# Altium schematic sheet RemoteCar_V1.0.SchDoc
size A4; SheetNumber: 1; SheetTotal: 1
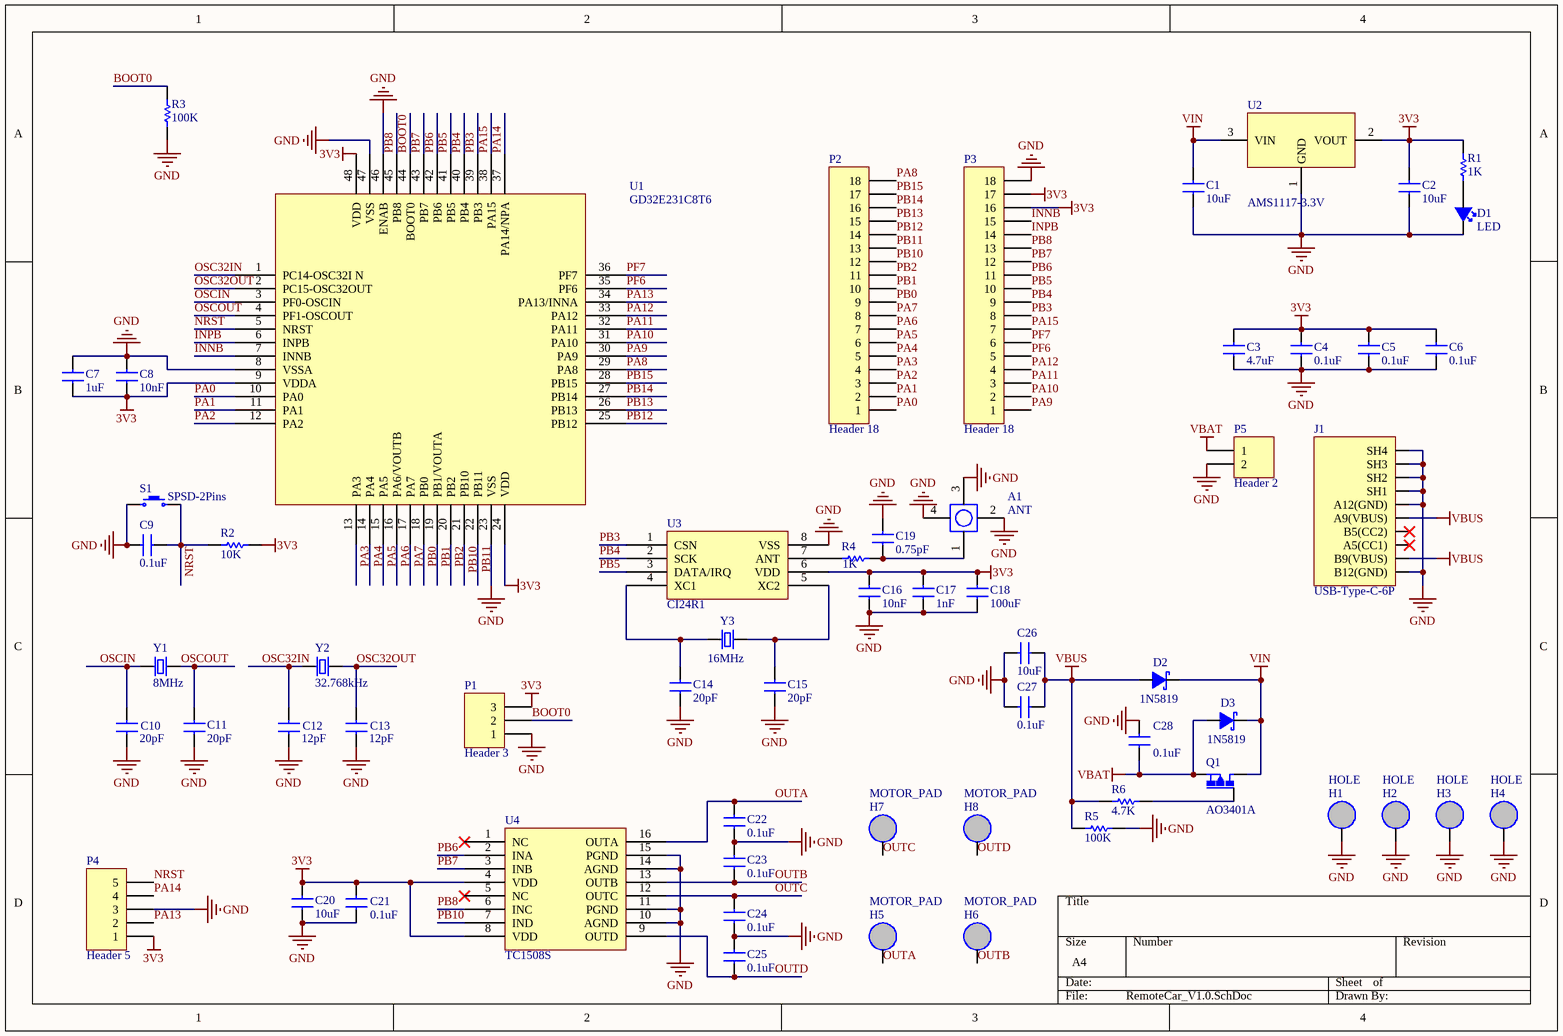
[diagram p0: RemoteCar_V1.0.SchDoc]

## Parts
A1  ANT  [IPEX1]
C1  10uF  [CAP-0603]
C2  10uF  [CAP-0603]
C3  4.7uF  [CAP-0603]
C4  0.1uF  [CAP-0402]
C5  0.1uF  [CAP-0402]
C6  0.1uF  [CAP-0402]
C7  1uF  [CAP-0402]
C8  10nF  [CAP-0402]
C9  0.1uF  [CAP-0402]
C10  20pF  [CAP-0603]
C11  20pF  [CAP-0603]
C12  12pF  [CAP-0603]
C13  12pF  [CAP-0603]
C14  20pF  [CAP-0603]
C15  20pF  [CAP-0603]
C16  10nF  [CAP-0402]
C17  1nF  [CAP-0402]
C18  100uF  [CAP-1206]
C19  0.75pF  [CAP-0402]
C20  10uF  [CAP-0603]
C21  0.1uF  [CAP-0402]
C22  0.1uF  [CAP-0402]
C23  0.1uF  [CAP-0402]
C24  0.1uF  [CAP-0402]
C25  0.1uF  [CAP-0402]
C26  10uF  [CAP-0603]
C27  0.1uF  [CAP-0402]
C28  0.1uF  [CAP-0402]
D1  LED  [LED-0603]
D2  1N5819  [DO-214AC]
D3  1N5819  [DO-214AC]
H1  HOLE  [HOLE]
H2  HOLE  [HOLE]
H3  HOLE  [HOLE]
H4  HOLE  [HOLE]
H5  MOTOR_PAD  [MOTOR_PAD]
H6  MOTOR_PAD  [MOTOR_PAD]
H7  MOTOR_PAD  [MOTOR_PAD]
H8  MOTOR_PAD  [MOTOR_PAD]
J1  USB-Type-C-6P  [USB-Type-C-6P]
P1  Header 3  [HDR1X3]
P2  Header 18  [HDR1X18]
P3  Header 18  [HDR1X18]
P4  Header 5  [HDR1X5]
P5  Header 2  [HDR1X2]
Q1  AO3401A  [SOT95P240X115-3N]
R1  1K  [RES-0603]
R2  10K  [RES-0603]
R3  100K  [RES-0603]
R4  1K  [RES-0603]
R5  100K  [RES-0603]
R6  4.7K  [RES-0603]
S1  SPSD-2Pins  [TS-1101-X-X]
U1  GD32E231C8T6  [LQFP-48]
U2  AMS1117-3.3V  [SOT230P700X180-4N]
U3  CI24R1  [TSOP127P600X145-8N]
U4  TC1508S  [SOP127P600X180-16N]
Y1  8MHz  [HC-49S]
Y2  32.768kHz  [DT-26]
Y3  16MHz  [HC-49S]

## Nets
3V3: C2.2 C3.2 C4.2 C5.2 C6.2 C7.1 C8.1 C16.1 C17.1 C18.1 C20.1 C21.1 P1.3 P3.16 P3.17 P4.1 R1.2 R2.2 U1.9(VDDA) U1.24(VDD) U1.48(VDD) U2.2(VOUT) U3.6(VDD) U4.4(VDD) U4.8(VDD)
GND: A1.2(GND) A1.3(GND) A1.4(GND) C1.1 C2.1 C3.1 C4.1 C5.1 C6.1 C7.2 C8.2 C9.2 C10.2 C11.2 C12.2 C13.2 C14.2 C15.1 C16.2 C17.2 C18.2 C19.1 C20.2 C21.2 C22.1 C23.1 C24.2 C25.1 C26.2 C27.2 C28.2 D1.2(Cathode) H1.1(GND) H2.1(GND) H3.1(GND) H4.1(GND) J1.1(B12(GND)) J1.6(A12(GND)) J1.7(SH1) J1.8(SH2) J1.9(SH3) J1.10(SH4) P1.1 P3.18 P4.3 P5.2 R3.1 R5.2 S1.1 U1.8(VSSA) U1.23(VSS) U1.46(ENAB) U1.47(VSS) U2.1(GND) U3.8(VSS) U4.10(AGND) U4.11(PGND) U4.14(AGND) U4.15(PGND)
VBAT: C28.1 D3.1(Positive) P5.1 Q1.2(S)
VBUS: C26.1 C27.1 D2.1(Positive) J1.2(B9(VBUS)) J1.5(A9(VBUS)) R5.1 R6.1
VIN: C1.2 D2.2(Cathode) D3.2(Cathode) Q1.3(D) U2.3(VIN)
BOOT0: P1.2 R3.2 U1.44(BOOT0)
INNB: P3.15 U1.7(INNB)
INPB: P3.14 U1.6(INPB)
NRST: C9.1 P4.5 R2.1 S1.2 U1.5(NRST)
OSC32IN: C12.1 U1.1(PC14-OSC32I_N) Y2.1
OSC32OUT: C13.1 U1.2(PC15-OSC32OUT) Y2.2
OSCIN: C10.1 U1.3(PF0-OSCIN) Y1.1
OSCOUT: C11.1 U1.4(PF1-OSCOUT) Y1.2
OUTA: C22.2 H5.1(MOTOR) U4.16(OUTA)
OUTB: C23.2 H6.1(MOTOR) U4.13(OUTB)
OUTC: C24.1 H7.1(MOTOR) U4.12(OUTC)
OUTD: C25.2 H8.1(MOTOR) U4.9(OUTD)
PA0: P2.1 U1.10(PA0)
PA1: P2.2 U1.11(PA1)
PA2: P2.3 U1.12(PA2)
PA3: P2.4 U1.13(PA3)
PA4: P2.5 U1.14(PA4)
PA5: P2.6 U1.15(PA5)
PA6: P2.7 U1.16(PA6/VOUTB)
PA7: P2.8 U1.17(PA7)
PA8: P2.18 U1.29(PA8)
PA9: P3.1 U1.30(PA9)
PA10: P3.2 U1.31(PA10)
PA11: P3.3 U1.32(PA11)
PA12: P3.4 U1.33(PA12)
PA13: P4.2 U1.34(PA13/INNA)
PA14: P4.4 U1.37(PA14/NPA)
PA15: P3.7 U1.38(PA15)
PB0: P2.9 U1.18(PB0)
PB1: P2.10 U1.19(PB1/VOUTA)
PB2: P2.11 U1.20(PB2)
PB3: P3.8 U1.39(PB3) U3.1(CSN)
PB4: P3.9 U1.40(PB4) U3.2(SCK)
PB5: P3.10 U1.41(PB5) U3.3(DATA/IRQ)
PB6: P3.11 U1.42(PB6) U4.2(INA)
PB7: P3.12 U1.43(PB7) U4.3(INB)
PB8: P3.13 U1.45(PB8) U4.6(INC)
PB10: P2.12 U1.21(PB10) U4.7(IND)
PB11: P2.13 U1.22(PB11)
PB12: P2.14 U1.25(PB12)
PB13: P2.15 U1.26(PB13)
PB14: P2.16 U1.27(PB14)
PB15: P2.17 U1.28(PB15)
PF6: P3.5 U1.35(PF6)
PF7: P3.6 U1.36(PF7)
NetA1_1: A1.1(SIG) C19.2 R4.2
NetC14_1: C14.1 U3.4(XC1) Y3.1
NetC15_2: C15.2 U3.5(XC2) Y3.2
NetD1_1: D1.1(Positive) R1.1
NetQ1_1: Q1.1(G) R6.2
NetR4_1: R4.1 U3.7(ANT)

Not connected (* = marked no-connect by the designer): J1 3(A5(CC1))* 4(B5(CC2))*; U4 1(NC)* 5(NC)*

## Library data of the parts
C1-C28 = Capacitor
D2 D3 = Diode Schottky
P1 = Header 3: Header, 3-Pin; LatestRevisionDate: 17-Jul-2002; LatestRevisionNote: Re-released for DXP Platform.; Publisher: Altium Limited
P2 P3 = Header 18: Header, 18-Pin; LatestRevisionDate: 17-Jul-2002; LatestRevisionNote: Re-released for DXP Platform.; Publisher: Altium Limited
P4 = Header 5: Header, 5-Pin; LatestRevisionDate: 17-Jul-2002; LatestRevisionNote: Re-released for DXP Platform.; Publisher: Altium Limited
P5 = Header 2: Header, 2-Pin; LatestRevisionDate: 17-Jul-2002; LatestRevisionNote: Re-released for DXP Platform.; Publisher: Altium Limited
Q1 = P-Channel MOSFET
R1-R6 = Resistor
S1 = SPSD 2Pins
Y1-Y3 = Crystal 2P